# Altium schematic sheet fpga_power.SchDoc: FPGA
size 297 x 209 mm; CheckedBy: MC, TW, EB; CompanyName: CERN; DrawnBy: Greg Kasprowicz; Organization: CERN; Address1: European Organization for Nuclear Research; Address2: CH-1211 Geneve 23 - Switzerland; DocumentNumber: 9; Revision: -; SheetNumber: 9; SheetTotal: 17; EDA_Number: EDA-02189-V4-0; Projet: Simple PCIe Carrier Board; ModifiedBy: TW, MC; CreateDate: 10/07/2010; CheckedDate: 11/05/2011; Title2: Power supplies; DivGrp: BE-CO; Designer: GK, MC, TW, EB, PAS; DocumentName: fpga_power.SchDoc; ModifiedDate: -
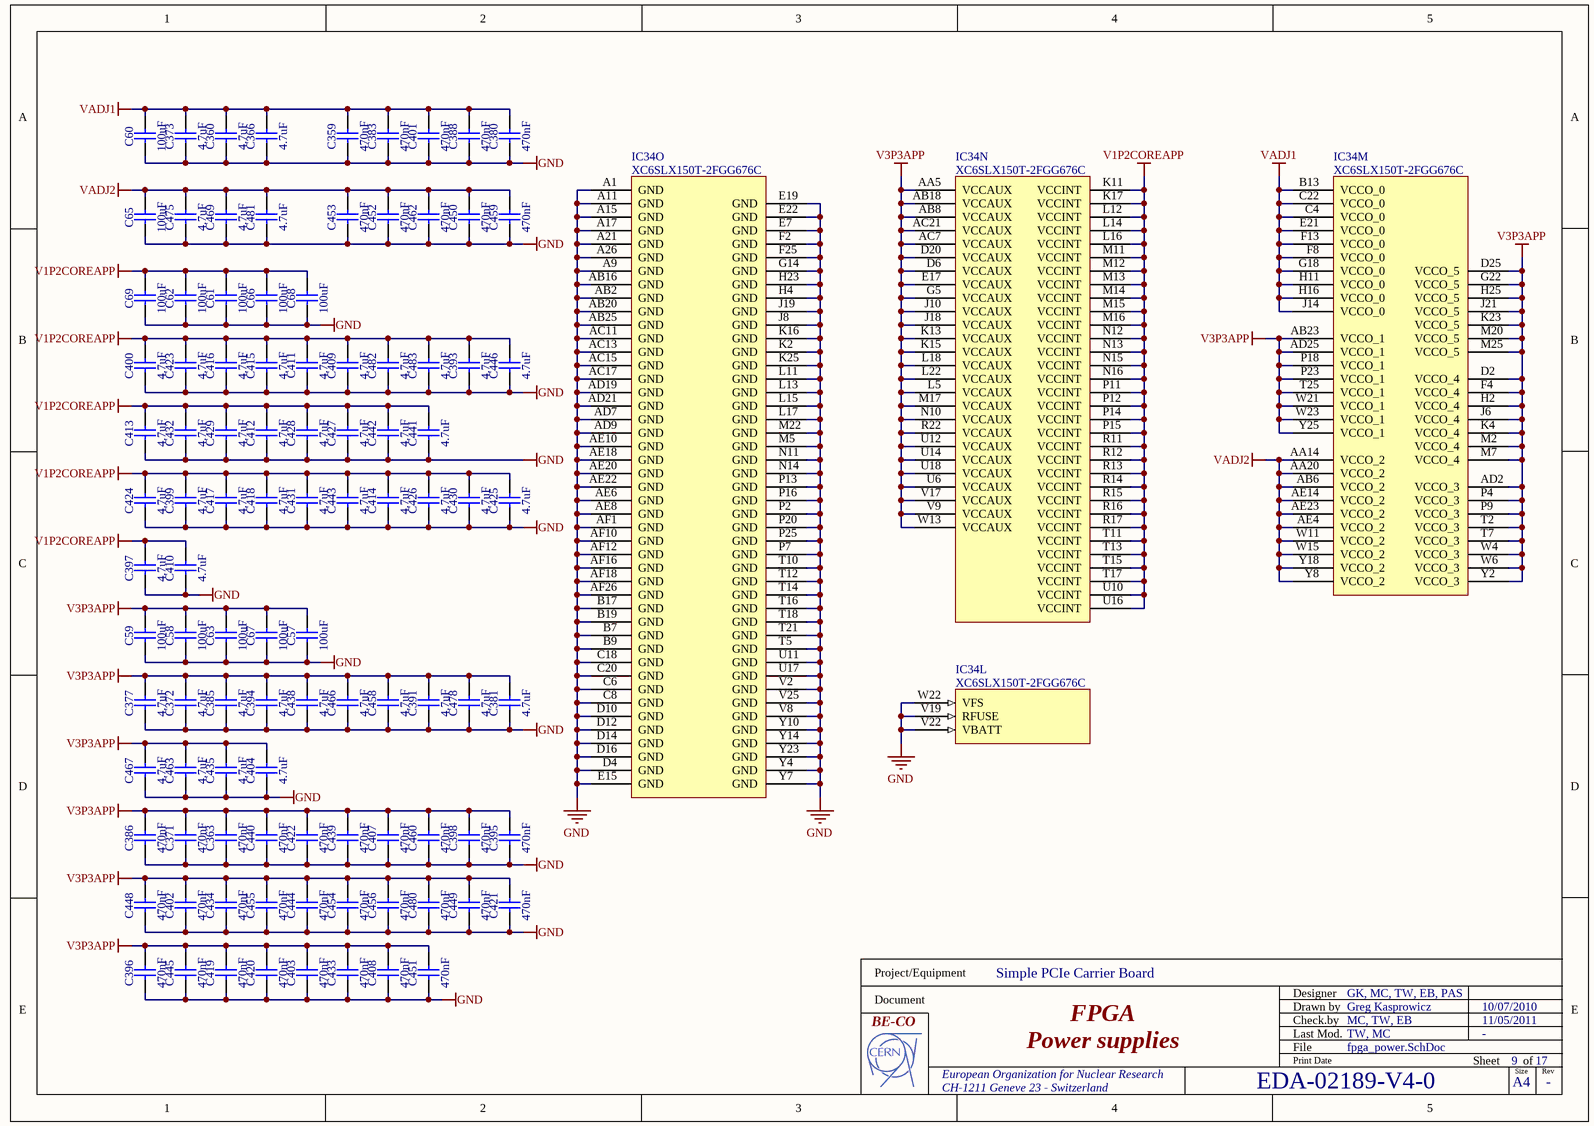
[diagram p0: fpga_power.SchDoc]

## Parts
C57  100uF  [CAPC3225X270N]
C58  100uF  [CAPC3225X270N]
C59  100uF  [CAPC3225X270N]
C60  100uF  [CAPC3225X270N]
C61  100uF  [CAPC3225X270N]
C62  100uF  [CAPC3225X270N]
C63  100uF  [CAPC3225X270N]
C65  100uF  [CAPC3225X270N]
C66  100uF  [CAPC3225X270N]
C67  100uF  [CAPC3225X270N]
C68  100uF  [CAPC3225X270N]
C69  100uF  [CAPC3225X270N]
C359  470nF  [CAPC1005X55N]
C360  4.7uF  [CAPC1005X55N]
C363  470nF  [CAPC1005X55N]
C366  4.7uF  [CAPC1005X55N]
C371  470nF  [CAPC1005X55N]
C372  4.7uF  [CAPC1005X55N]
C373  4.7uF  [CAPC1005X55N]
C377  4.7uF  [CAPC1005X55N]
C380  470nF  [CAPC1005X55N]
C381  4.7uF  [CAPC1005X55N]
C383  470nF  [CAPC1005X55N]
C385  4.7uF  [CAPC1005X55N]
C386  470nF  [CAPC1005X55N]
C388  470nF  [CAPC1005X55N]
C391  4.7uF  [CAPC1005X55N]
C393  4.7uF  [CAPC1005X55N]
C394  4.7uF  [CAPC1005X55N]
C395  470nF  [CAPC1005X55N]
C396  470nF  [CAPC1005X55N]
C397  4.7uF  [CAPC1005X55N]
C398  470nF  [CAPC1005X55N]
C399  4.7uF  [CAPC1005X55N]
C400  4.7uF  [CAPC1005X55N]
C401  470nF  [CAPC1005X55N]
C402  470nF  [CAPC1005X55N]
C403  470nF  [CAPC1005X55N]
C404  4.7uF  [CAPC1005X55N]
C407  470nF  [CAPC1005X55N]
C408  470nF  [CAPC1005X55N]
C409  4.7uF  [CAPC1005X55N]
C410  4.7uF  [CAPC1005X55N]
C411  4.7uF  [CAPC1005X55N]
C412  4.7uF  [CAPC1005X55N]
C413  4.7uF  [CAPC1005X55N]
C414  4.7uF  [CAPC1005X55N]
C415  4.7uF  [CAPC1005X55N]
C416  4.7uF  [CAPC1005X55N]
C417  4.7uF  [CAPC1005X55N]
C418  4.7uF  [CAPC1005X55N]
C419  470nF  [CAPC1005X55N]
C420  470nF  [CAPC1005X55N]
C421  470nF  [CAPC1005X55N]
C422  470nF  [CAPC1005X55N]
C423  4.7uF  [CAPC1005X55N]
C424  4.7uF  [CAPC1005X55N]
C425  4.7uF  [CAPC1005X55N]
C426  4.7uF  [CAPC1005X55N]
C427  4.7uF  [CAPC1005X55N]
C428  4.7uF  [CAPC1005X55N]
C429  4.7uF  [CAPC1005X55N]
C430  4.7uF  [CAPC1005X55N]
C431  4.7uF  [CAPC1005X55N]
C432  4.7uF  [CAPC1005X55N]
C433  470nF  [CAPC1005X55N]
C434  470nF  [CAPC1005X55N]
C435  4.7uF  [CAPC1005X55N]
C438  4.7uF  [CAPC1005X55N]
C439  470nF  [CAPC1005X55N]
C440  470nF  [CAPC1005X55N]
C441  4.7uF  [CAPC1005X55N]
C442  4.7uF  [CAPC1005X55N]
C443  4.7uF  [CAPC1005X55N]
C444  470nF  [CAPC1005X55N]
C445  470nF  [CAPC1005X55N]
C446  4.7uF  [CAPC1005X55N]
C448  470nF  [CAPC1005X55N]
C449  470nF  [CAPC1005X55N]
C450  470nF  [CAPC1005X55N]
C451  470nF  [CAPC1005X55N]
C452  470nF  [CAPC1005X55N]
C453  470nF  [CAPC1005X55N]
C454  470nF  [CAPC1005X55N]
C455  470nF  [CAPC1005X55N]
C456  470nF  [CAPC1005X55N]
C458  4.7uF  [CAPC1005X55N]
C459  470nF  [CAPC1005X55N]
C460  470nF  [CAPC1005X55N]
C462  470nF  [CAPC1005X55N]
C463  4.7uF  [CAPC1005X55N]
C466  4.7uF  [CAPC1005X55N]
C467  4.7uF  [CAPC1005X55N]
C469  4.7uF  [CAPC1005X55N]
C475  4.7uF  [CAPC1005X55N]
C478  4.7uF  [CAPC1005X55N]
C480  470nF  [CAPC1005X55N]
C481  4.7uF  [CAPC1005X55N]
C482  4.7uF  [CAPC1005X55N]
C483  4.7uF  [CAPC1005X55N]
IC34  XC6SLX150T-2FGG676C  [BGA676C100P26X26_2700X2700X260]  (parts L,M,N,O of 15)

## Nets
GND: C57.1 C58.1 C59.1 C60.1 C61.1 C62.1 C63.1 C65.1 C66.1 C67.1 C68.1 C69.1 C359.1 C360.1 C363.1 C366.1 C371.1 C372.1 C373.1 C377.1 C380.1 C381.1 C383.1 C385.1 C386.1 C388.1 C391.1 C393.1 C394.1 C395.1 C396.1 C397.1 C398.1 C399.1 C400.1 C401.1 C402.1 C403.1 C404.1 C407.1 C408.1 C409.1 C410.1 C411.1 C412.1 C413.1 C414.1 C415.1 C416.1 C417.1 C418.1 C419.1 C420.1 C421.1 C422.1 C423.1 C424.1 C425.1 C426.1 C427.1 C428.1 C429.1 C430.1 C431.1 C432.1 C433.1 C434.1 C435.1 C438.1 C439.1 C440.1 C441.1 C442.1 C443.1 C444.1 C445.1 C446.1 C448.1 C449.1 C450.1 C451.1 C452.1 C453.1 C454.1 C455.1 C456.1 C458.1 C459.1 C460.1 C462.1 C463.1 C466.1 C467.1 C469.1 C475.1 C478.1 C480.1 C481.1 C482.1 C483.1 IC34.A1(GND) IC34.A9(GND) IC34.A11(GND) IC34.A15(GND) IC34.A17(GND) IC34.A21(GND) IC34.A26(GND) IC34.AB2(GND) IC34.AB16(GND) IC34.AB20(GND) IC34.AB25(GND) IC34.AC11(GND) IC34.AC13(GND) IC34.AC15(GND) IC34.AC17(GND) IC34.AD7(GND) IC34.AD9(GND) IC34.AD19(GND) IC34.AD21(GND) IC34.AE6(GND) IC34.AE8(GND) IC34.AE10(GND) IC34.AE18(GND) IC34.AE20(GND) IC34.AE22(GND) IC34.AF1(GND) IC34.AF10(GND) IC34.AF12(GND) IC34.AF16(GND) IC34.AF18(GND) IC34.AF26(GND) IC34.B7(GND) IC34.B9(GND) IC34.B17(GND) IC34.B19(GND) IC34.C6(GND) IC34.C8(GND) IC34.C18(GND) IC34.C20(GND) IC34.D4(GND) IC34.D10(GND) IC34.D12(GND) IC34.D14(GND) IC34.D16(GND) IC34.E7(GND) IC34.E15(GND) IC34.E19(GND) IC34.E22(GND) IC34.F2(GND) IC34.F25(GND) IC34.G14(GND) IC34.H4(GND) IC34.H23(GND) IC34.J8(GND) IC34.J19(GND) IC34.K2(GND) IC34.K16(GND) IC34.K25(GND) IC34.L11(GND) IC34.L13(GND) IC34.L15(GND) IC34.L17(GND) IC34.M5(GND) IC34.M22(GND) IC34.N11(GND) IC34.N14(GND) IC34.P2(GND) IC34.P7(GND) IC34.P13(GND) IC34.P16(GND) IC34.P20(GND) IC34.P25(GND) IC34.T5(GND) IC34.T10(GND) IC34.T12(GND) IC34.T14(GND) IC34.T16(GND) IC34.T18(GND) IC34.T21(GND) IC34.U11(GND) IC34.U17(GND) IC34.V2(GND) IC34.V8(GND) IC34.V19(RFUSE) IC34.V22(VBATT) IC34.V25(GND) IC34.W22(VFS) IC34.Y4(GND) IC34.Y7(GND) IC34.Y10(GND) IC34.Y14(GND) IC34.Y23(GND)
V1P2COREAPP: C61.2 C62.2 C66.2 C68.2 C69.2 C393.2 C397.2 C399.2 C400.2 C409.2 C410.2 C411.2 C412.2 C413.2 C414.2 C415.2 C416.2 C417.2 C418.2 C423.2 C424.2 C425.2 C426.2 C427.2 C428.2 C429.2 C430.2 C431.2 C432.2 C441.2 C442.2 C443.2 C446.2 C482.2 C483.2 IC34.K11(VCCINT) IC34.K17(VCCINT) IC34.L12(VCCINT) IC34.L14(VCCINT) IC34.L16(VCCINT) IC34.M11(VCCINT) IC34.M12(VCCINT) IC34.M13(VCCINT) IC34.M14(VCCINT) IC34.M15(VCCINT) IC34.M16(VCCINT) IC34.N12(VCCINT) IC34.N13(VCCINT) IC34.N15(VCCINT) IC34.N16(VCCINT) IC34.P11(VCCINT) IC34.P12(VCCINT) IC34.P14(VCCINT) IC34.P15(VCCINT) IC34.R11(VCCINT) IC34.R12(VCCINT) IC34.R13(VCCINT) IC34.R14(VCCINT) IC34.R15(VCCINT) IC34.R16(VCCINT) IC34.R17(VCCINT) IC34.T11(VCCINT) IC34.T13(VCCINT) IC34.T15(VCCINT) IC34.T17(VCCINT) IC34.U10(VCCINT) IC34.U16(VCCINT)
V3P3APP: C57.2 C58.2 C59.2 C63.2 C67.2 C363.2 C371.2 C372.2 C377.2 C381.2 C385.2 C386.2 C391.2 C394.2 C395.2 C396.2 C398.2 C402.2 C403.2 C404.2 C407.2 C408.2 C419.2 C420.2 C421.2 C422.2 C433.2 C434.2 C435.2 C438.2 C439.2 C440.2 C444.2 C445.2 C448.2 C449.2 C451.2 C454.2 C455.2 C456.2 C458.2 C460.2 C463.2 C466.2 C467.2 C478.2 C480.2 IC34.AA5(VCCAUX) IC34.AB8(VCCAUX) IC34.AB18(VCCAUX) IC34.AB23(VCCO_1) IC34.AC7(VCCAUX) IC34.AC21(VCCAUX) IC34.AD2(VCCO_3) IC34.AD25(VCCO_1) IC34.D2(VCCO_4) IC34.D6(VCCAUX) IC34.D20(VCCAUX) IC34.D25(VCCO_5) IC34.E17(VCCAUX) IC34.F4(VCCO_4) IC34.G5(VCCAUX) IC34.G22(VCCO_5) IC34.H2(VCCO_4) IC34.H25(VCCO_5) IC34.J6(VCCO_4) IC34.J10(VCCAUX) IC34.J18(VCCAUX) IC34.J21(VCCO_5) IC34.K4(VCCO_4) IC34.K13(VCCAUX) IC34.K15(VCCAUX) IC34.K23(VCCO_5) IC34.L5(VCCAUX) IC34.L18(VCCAUX) IC34.L22(VCCAUX) IC34.M2(VCCO_4) IC34.M7(VCCO_4) IC34.M17(VCCAUX) IC34.M20(VCCO_5) IC34.M25(VCCO_5) IC34.N10(VCCAUX) IC34.P4(VCCO_3) IC34.P9(VCCO_3) IC34.P18(VCCO_1) IC34.P23(VCCO_1) IC34.R22(VCCAUX) IC34.T2(VCCO_3) IC34.T7(VCCO_3) IC34.T25(VCCO_1) IC34.U6(VCCAUX) IC34.U12(VCCAUX) IC34.U14(VCCAUX) IC34.U18(VCCAUX) IC34.V9(VCCAUX) IC34.V17(VCCAUX) IC34.W4(VCCO_3) IC34.W6(VCCO_3) IC34.W13(VCCAUX) IC34.W21(VCCO_1) IC34.W23(VCCO_1) IC34.Y2(VCCO_3) IC34.Y25(VCCO_1)
VADJ1: C60.2 C359.2 C360.2 C366.2 C373.2 C380.2 C383.2 C388.2 C401.2 IC34.B13(VCCO_0) IC34.C4(VCCO_0) IC34.C22(VCCO_0) IC34.E21(VCCO_0) IC34.F8(VCCO_0) IC34.F13(VCCO_0) IC34.G18(VCCO_0) IC34.H11(VCCO_0) IC34.H16(VCCO_0) IC34.J14(VCCO_0)
VADJ2: C65.2 C450.2 C452.2 C453.2 C459.2 C462.2 C469.2 C475.2 C481.2 IC34.AA14(VCCO_2) IC34.AA20(VCCO_2) IC34.AB6(VCCO_2) IC34.AE4(VCCO_2) IC34.AE14(VCCO_2) IC34.AE23(VCCO_2) IC34.W11(VCCO_2) IC34.W15(VCCO_2) IC34.Y8(VCCO_2) IC34.Y18(VCCO_2)

## Notes on the sheet
- Project/Equipment
- Document
- Designer
- Drawn by
- Check.by
- File
- Last Mod.
- Print Date
- Sheet
- Size
- A4
- of
- Rev

## Library data of the parts
C57-C63 C65-C69 = CC1210_100UF_6.3V_20%_X5R: Non-polarised capacitor; Part Description: SMD Multilayer Chip Ceramic Capacitor; Manufacturer: GENERIC; Manufacturer1 Part Number: GRM32ER60J107ME20L; Voltage: 6.3V; TC: X5R; Tolerance: ±20%; Table: Capacitors SMD; Part Number: CC1210_100UF_6.3V_20%_X5R; Component Kind: Standard; Component Type: Standard; Pin Count: 2; Value: 100uF; Status: Preferred; Manufacturer Part Number: CC1210_100UF_6.3V_20%_X5R; Case: 1210; Mounted: Yes; Socket: No; SMD: Yes; Manufacturer1 Example: MURATA; Manufacturer1 ComponentHeight: 2.70mm; HelpURL: \\cern.ch\dfs\Applications\Altium\Datasheets\CC1210_X5R_MURATA.pdf; Author: CERN DEM JLC; CreateDate: 19/04/2010; LatestRevisionDate: 19/04/2010
C359 C363 C371 C380 C383 C386 C388 C395 C396 C398 C401-C403 C407 C408 C419-C422 C433 C434 C439 C440 C444 C445 C448-C456 C459 C460 C462 C480 = CC0402_470NF_6.3V_10%_X5R: Non-polarised capacitor; Part Description: SMD Multilayer Chip Ceramic Capacitor; Manufacturer: GENERIC; Manufacturer1 Part Number: GRM155R60J474KE19D; Voltage: 6.3V; TC: X5R; Tolerance: ±10%; Table: Capacitors SMD; Part Number: CC0402_470NF_6.3V_10%_X5R; Component Kind: Standard; Component Type: Standard; Pin Count: 2; Value: 470nF; Status: Preferred; Manufacturer Part Number: CC0402_470NF_6.3V_10%_X5R; Case: 0402; Mounted: Yes; Socket: No; SMD: Yes; Manufacturer1 Example: MURATA; Manufacturer1 ComponentHeight: 0.55mm; HelpURL: \\cern.ch\dfs\Applications\Altium\Datasheets\CC0402_X5R_MURATA_GRM.pdf; Author: CERN DEM JLC; CreateDate: 22/04/2010; LatestRevisionDate: 22/04/2010
C360 C366 C372 C373 C377 C381 C385 C391 C393 C394 C397 C399 C400 C404 C409-C418 C423-C432 C435 C438 C441-C443 C446 C458 C463 C466 C467 C469 C475 C478 C481-C483 = CC0402_4.7UF_4V_20%_X5R: Non-polarised capacitor; Part Description: SMD Multilayer Chip Ceramic Capacitor; Manufacturer: GENERIC; Manufacturer1 Part Number: C0402C475M7PAC; Voltage: 4V; TC: X5R; Tolerance: ±20%; Table: Capacitors SMD; Part Number: CC0402_4.7UF_4V_20%_X5R; Component Kind: Standard; Component Type: Standard; Pin Count: 2; Value: 4.7uF; Status: Preferred; Manufacturer Part Number: CC0402_4.7UF_4V_20%_X5R; Case: 0402; Mounted: Yes; Socket: No; SMD: Yes; Manufacturer1 Example: KEMET; Manufacturer1 ComponentHeight: 0.55mm; HelpURL: \\cern.ch\dfs\Applications\Altium\Datasheets\CC0402_X5R_KEMET.pdf; Author: CERN DEM JLC; CreateDate: 08/06/2010; LatestRevisionDate: 08/06/2010
IC34 = XC6SLX150T-2FGG676C: SPARTAN-6, FPGA, 676-Ball BGA, Commercial Grade, Pb-Free; Part Description: SPARTAN-6, FPGA, 396 User I/Os, 8 GTPs, 676-Ball BGA, Commercial Grade, Pb-Free; Manufacturer: XILINX; Table: Logic; Part Number: XC6SLX150T-2FGG676C; Component Kind: Standard; Component Type: Standard; Device: XC6SLX150T-2FGG676C; PackageDescription: BGA,1.00mm pitch, square; 676 pin, 26 columns X 26 rows, 27.00mm X 27.00mm X 2.60mm H, IPC Medium Density; Manufacturer Part Number: XC6SLX150T-2FGG676C; Pin Count: 676; Case: BGA676; Mounted: Yes; Socket: No; SMD: Yes; ComponentHeight: 2.6mm; HelpURL: \\cern.ch\dfs\Applications\Altium\Datasheets\XC6SLX150T-2FGG676C.pdf; ComponentLink1URL: \\cern.ch\dfs\Applications\Altium\Datasheets\XC6SLX150T-2FGG676C_Package-Pinouts.pdf; ComponentLink1Description: Package/Pinouts; Author: CERN DEM JLC; CreateDate: 11/17/2009; LatestRevisionDate: 11/17/2009